# Altium schematic sheet ina.SchDoc: INA STAGE
size A4; Organization: Altium Limited; Address1: L3, 12a Rodborough Rd; Address2: Frenchs Forest; Address3: NSW; Address4: Australia 2086; DocumentNumber: 1; Revision: 1
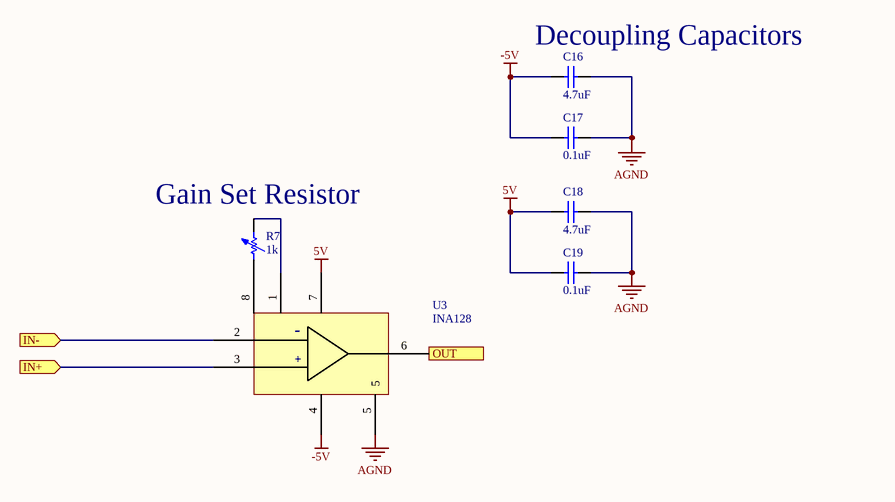
[diagram p0: ina.SchDoc]

## Parts
C16  4.7uF  [0402_Cap]
C17  0.1uF  [0402_Cap]
C18  4.7uF  [0402_Cap]
C19  0.1uF  [0402_Cap]
R7  1k  [TRIMRES]
U3  INA128  [SOIC_8]

## Ports
IN+ (in), IN- (in), OUT (out)

## Nets
5V: C18.1 C19.1 U3.7
-5V: C16.1 C17.1 U3.4
AGND: C16.2 C17.2 C18.2 C19.2 U3.5
IN+: U3.3 ; port IN+
IN-: U3.2 ; port IN-
OUT: U3.6 ; port OUT
NetR7_1: R7.1 U3.8(Gain)
NetR7_2: R7.2 U3.1(Gain)

## Notes on the sheet
- (near C16) Decoupling Capacitors
- (near R7) Gain Set Resistor
- Title
- Date:
- RE:
- Arturo di Girolamo
- Size:
- A3
- A
- (in symbol INA128UA/2K5) -; +

## Library data of the parts
C16 C18 = CL21A475KAQNNNE: Capacitor, 4.7uF, 0805; Value: .01uf; ASYPN: GRM155R61A475MEAAD; MFGPN: CL21A475KAQNNNE
C17 C19 = CL21B104KACNNNC: Capacitor, 0.1uF, 0805; Value: .01uf; ASYPN: 0402YC104KAT2A; MFGPN: CL21B104KACNNNC
R7 = PV36W102C01B00_RES: Variable resistor 1k; MFGPN: PV36W102C01B00
U3 = INA128UA/2K5: Instrumentation Amp, Generic; ASYPN: INA828IDR; MFGPN: INA128UA/2K5